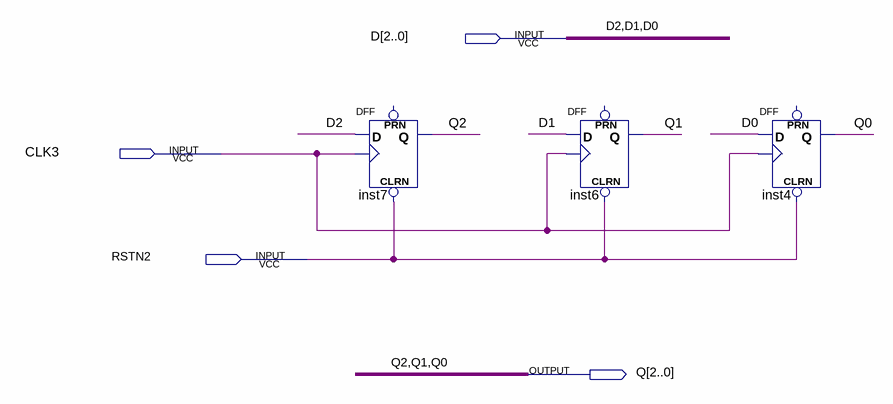
[diagram p0: schematic sheet]
// Quartus schematic reg3.bdf as structural Verilog: 3 symbols, 4 pins
module reg3 (
  input  [2:0] D,
  input  CLK3,
  input  RSTN2,
  output [2:0] Q
);

  DFF inst7 (.CLRN(RSTN2), .CLK(CLK3), .D(D[2]), .Q(Q[2]));  // open: PRN
  DFF inst6 (.CLRN(RSTN2), .CLK(CLK3), .D(D[1]), .Q(Q[1]));  // open: PRN
  DFF inst4 (.CLRN(RSTN2), .CLK(CLK3), .D(D[0]), .Q(Q[0]));  // open: PRN
endmodule
